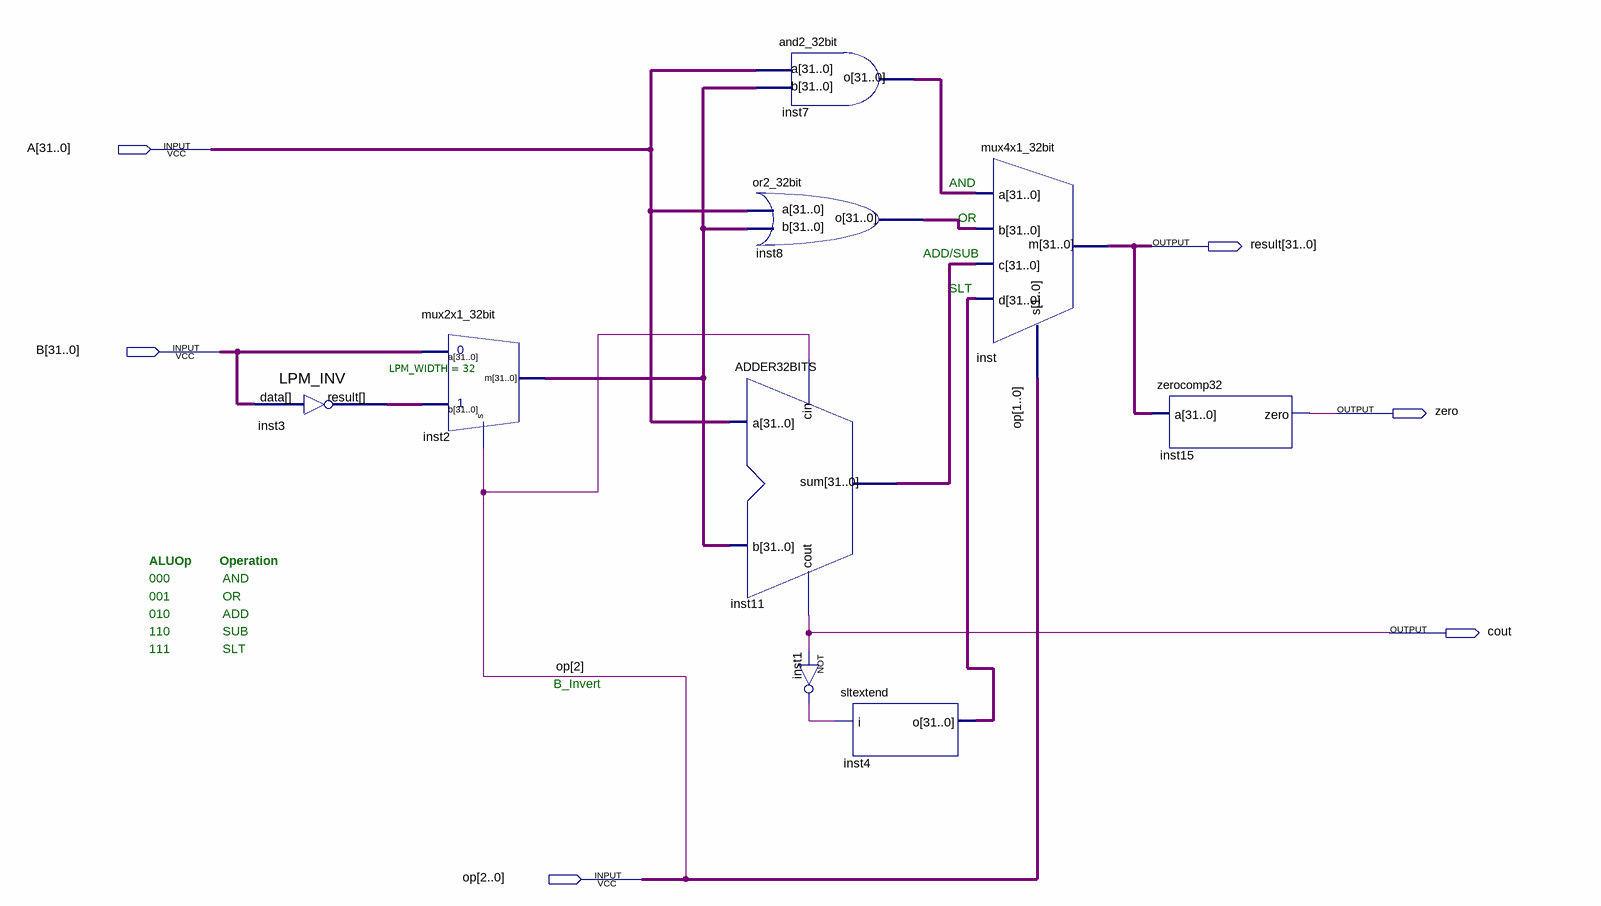
[diagram p0: schematic sheet]
// Quartus schematic MIPS-ALU.bdf as structural Verilog: 9 symbols, 6 pins
module \MIPS-ALU  (
  input  [31:0] A,
  input  [31:0] B,
  input  [2:0] op,
  output [31:0] result,
  output zero,
  output cout
);

  wire inst1_out;
  wire [31:0] inst2_m, inst3_result, inst4_o, inst7_o, inst8_o, inst11_sum;

  LPM_INV #(.LPM_WIDTH(32)) inst3 (.data(B), .result(inst3_result));
  mux2x1_32bit inst2 (.s(op[2]), .a(B), .b(inst3_result), .m(inst2_m));
  and2_32bit inst7 (.a(A), .b(inst2_m), .o(inst7_o));
  or2_32bit inst8 (.a(A), .b(inst2_m), .o(inst8_o));
  ADDER32BITS inst11 (.a(A), .b(inst2_m), .cin(op[2]), .cout(cout), .sum(inst11_sum));
  not inst1 (inst1_out, cout);
  sltextend inst4 (.i(inst1_out), .o(inst4_o));
  mux4x1_32bit inst (.a(inst7_o), .b(inst8_o), .c(inst11_sum), .d(inst4_o), .s(op[1:0]), .m(result));
  zerocomp32 inst15 (.a(result), .zero(zero));

  // Notes on the sheet:
  //   AND
  //   OR
  //   ADD/SUB
  //   SLT
  //   ALUOp        Operation
  //   000               AND
  //   001               OR
  //   010               ADD
  //   110               SUB
  //   111               SLT
  //   B_Invert
endmodule
